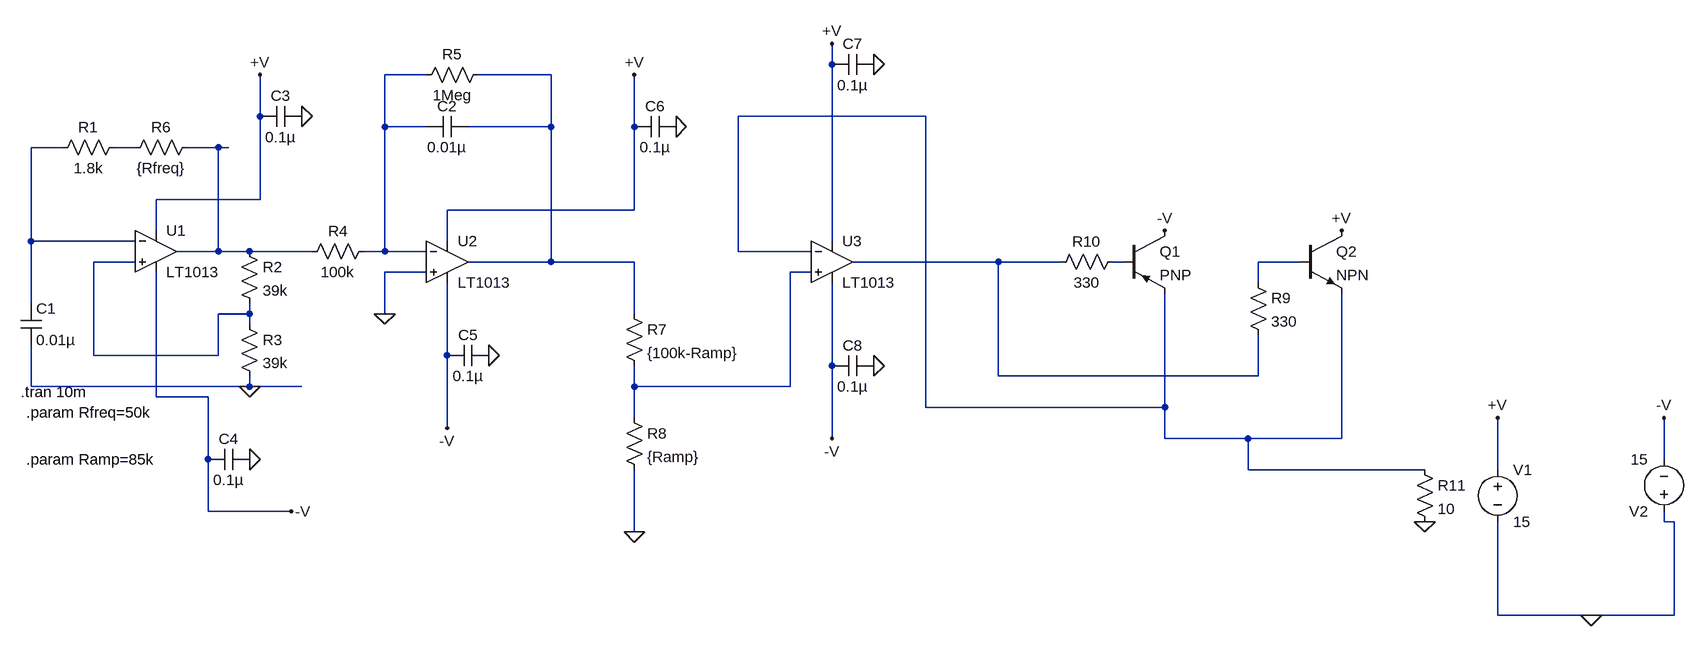
[diagram p0: schematic Function Generator LTspice.asc]
Function Generator LTspice.asc, the LTspice schematic file:
Version 4.1
SHEET 1 1684 680
WIRE 368 -272 368 -304
WIRE -256 -256 -320 -256
WIRE -64 -256 -176 -256
WIRE -512 -192 -512 -256
WIRE 512 -192 224 -192
WIRE -320 -176 -320 -256
WIRE -256 -176 -320 -176
WIRE -64 -176 -64 -256
WIRE -64 -176 -192 -176
WIRE 64 -176 64 -256
WIRE -816 -144 -864 -144
WIRE -704 -144 -736 -144
WIRE -576 -144 -624 -144
WIRE -560 -144 -576 -144
WIRE -512 -64 -512 -192
WIRE -512 -64 -672 -64
WIRE 64 -48 64 -176
WIRE 64 -48 -224 -48
WIRE -672 -16 -672 -64
WIRE -864 0 -864 -144
WIRE -704 0 -864 0
WIRE -224 0 -224 -48
WIRE 368 0 368 -272
WIRE -576 16 -576 -144
WIRE -576 16 -640 16
WIRE -528 16 -576 16
WIRE -432 16 -528 16
WIRE -320 16 -320 -176
WIRE -320 16 -352 16
WIRE -256 16 -320 16
WIRE 224 16 224 -192
WIRE 336 16 224 16
WIRE -704 32 -768 32
WIRE -64 32 -64 -176
WIRE -64 32 -192 32
WIRE 64 32 -64 32
WIRE 624 32 400 32
WIRE 720 32 624 32
WIRE 816 32 800 32
WIRE 1088 32 1024 32
WIRE -256 48 -320 48
WIRE 336 48 304 48
WIRE 1024 64 1024 32
WIRE -864 96 -864 0
WIRE -528 112 -528 96
WIRE -528 112 -576 112
WIRE -320 112 -320 48
WIRE 64 112 64 32
WIRE -528 128 -528 112
WIRE -768 176 -768 32
WIRE -576 176 -576 112
WIRE -576 176 -768 176
WIRE -224 176 -224 64
WIRE 368 192 368 64
WIRE 624 208 624 32
WIRE 1024 208 1024 144
WIRE 1024 208 624 208
WIRE -864 224 -864 160
WIRE -528 224 -528 208
WIRE -528 224 -864 224
WIRE -448 224 -528 224
WIRE 64 224 64 192
WIRE 304 224 304 48
WIRE 304 224 64 224
WIRE -672 240 -672 48
WIRE -592 240 -672 240
WIRE 512 256 512 -192
WIRE 880 256 880 80
WIRE 880 256 512 256
WIRE 64 272 64 224
WIRE -224 288 -224 176
WIRE 368 304 368 192
WIRE 880 304 880 256
WIRE 1008 304 880 304
WIRE 1152 304 1152 80
WIRE 1152 304 1008 304
WIRE -592 336 -592 240
WIRE 1648 336 1648 272
WIRE 1008 352 1008 304
WIRE 1280 352 1008 352
WIRE 1392 352 1392 272
WIRE -592 416 -592 336
WIRE -464 416 -592 416
WIRE 1648 432 1648 416
WIRE 1664 432 1648 432
WIRE 64 448 64 352
WIRE 1392 576 1392 432
WIRE 1536 576 1392 576
WIRE 1664 576 1664 432
WIRE 1664 576 1536 576
FLAG 1536 576 0
FLAG 1392 272 +V
FLAG -512 -256 +V
FLAG 1648 272 -V
FLAG -464 416 -V
FLAG -528 224 0
FLAG -320 112 0
FLAG 64 -256 +V
FLAG -224 288 -V
FLAG 64 448 0
FLAG 368 -304 +V
FLAG 368 304 -V
FLAG 1152 -16 +V
FLAG 880 -16 -V
FLAG 1280 432 0
FLAG -448 -192 0
FLAG -528 336 0
FLAG 128 -176 0
FLAG 432 -272 0
FLAG 432 192 0
FLAG -160 176 0
SYMBOL OpAmps\\LT1013 -672 -48 R0
SYMATTR InstName U1
SYMBOL cap -880 96 R0
SYMATTR InstName C1
SYMATTR Value 0.01µ
SYMBOL res -544 0 R0
SYMATTR InstName R2
SYMATTR Value 39k
SYMBOL res -544 112 R0
SYMATTR InstName R3
SYMATTR Value 39k
SYMBOL voltage 1392 336 R0
WINDOW 123 0 0 Left 0
WINDOW 39 0 0 Left 0
SYMATTR InstName V1
SYMATTR Value 15
SYMBOL voltage 1648 432 R180
WINDOW 123 0 0 Left 0
WINDOW 39 0 0 Left 0
SYMATTR InstName V2
SYMATTR Value 15
SYMBOL res -336 0 R90
WINDOW 0 0 56 VBottom 2
WINDOW 3 32 56 VTop 2
SYMATTR InstName R4
SYMATTR Value 100k
SYMBOL OpAmps\\LT1013 -224 -32 R0
SYMATTR InstName U2
SYMBOL cap -192 -192 R90
WINDOW 0 0 32 VBottom 2
WINDOW 3 32 32 VTop 2
SYMATTR InstName C2
SYMATTR Value 0.01µ
SYMBOL res -160 -272 R90
WINDOW 0 0 56 VBottom 2
WINDOW 3 32 56 VTop 2
SYMATTR InstName R5
SYMATTR Value 1Meg
SYMBOL res -720 -160 R90
WINDOW 0 0 56 VBottom 2
WINDOW 3 32 56 VTop 2
SYMATTR InstName R1
SYMATTR Value 1.8k
SYMBOL res -608 -160 R90
WINDOW 0 0 56 VBottom 2
WINDOW 3 32 56 VTop 2
SYMATTR InstName R6
SYMATTR Value {Rfreq}
SYMBOL res 48 96 R0
SYMATTR InstName R7
SYMATTR Value {100k-Ramp}
SYMBOL res 48 256 R0
SYMATTR InstName R8
SYMATTR Value {Ramp}
SYMBOL OpAmps\\LT1013 368 -32 R0
SYMATTR InstName U3
SYMBOL pnp 816 -16 R0
SYMATTR InstName Q1
SYMBOL npn 1088 -16 R0
SYMATTR InstName Q2
SYMBOL res 1008 48 R0
SYMATTR InstName R9
SYMATTR Value 330
SYMBOL res 816 16 R90
WINDOW 0 0 56 VBottom 2
WINDOW 3 32 56 VTop 2
SYMATTR InstName R10
SYMATTR Value 330
SYMBOL res 1264 336 R0
SYMATTR InstName R11
SYMATTR Value 10
SYMBOL cap -448 -208 R90
WINDOW 0 0 32 VBottom 2
WINDOW 3 32 32 VTop 2
SYMATTR InstName C3
SYMATTR Value 0.1µ
SYMBOL cap -528 320 R90
WINDOW 0 0 32 VBottom 2
WINDOW 3 32 32 VTop 2
SYMATTR InstName C4
SYMATTR Value 0.1µ
SYMBOL cap -160 160 R90
WINDOW 0 0 32 VBottom 2
WINDOW 3 32 32 VTop 2
SYMATTR InstName C5
SYMATTR Value 0.1µ
SYMBOL cap 128 -192 R90
WINDOW 0 0 32 VBottom 2
WINDOW 3 32 32 VTop 2
SYMATTR InstName C6
SYMATTR Value 0.1µ
SYMBOL cap 432 -288 R90
WINDOW 0 0 32 VBottom 2
WINDOW 3 32 32 VTop 2
SYMATTR InstName C7
SYMATTR Value 0.1µ
SYMBOL cap 432 176 R90
WINDOW 0 0 32 VBottom 2
WINDOW 3 32 32 VTop 2
SYMATTR InstName C8
SYMATTR Value 0.1µ
TEXT -880 232 Left 2 !.tran 10m
TEXT -872 264 Left 2 !.param Rfreq=50k
TEXT -872 336 Left 2 !.param Ramp=85k

The netlist it stands for:
* Function Generator LTspice.asc
X§U1 N007 N004 +V -V N006 LT1013  ; pins In+ In- V+ V- OUT
C1 N004 0 0.01µ
R2 N006 N007 39k
R3 N007 0 39k
V1 +V 0 15
V2 0 -V 15
R4 N001 N006 100k
X§U2 0 N001 +V -V N002 LT1013  ; pins In+ In- V+ V- OUT
C2 N002 N001 0.01µ
R5 N002 N001 1Meg
R1 N005 N004 1.8k
R6 N006 N005 {Rfreq}
R7 N002 N011 {100k-Ramp}
R8 N011 0 {Ramp}
X§U3 N011 N003 +V -V N008 LT1013  ; pins In+ In- V+ V- OUT
Q1 -V N009 N003 0 PNP
Q2 +V N010 N003 0 NPN
R9 N010 N008 330
R10 N009 N008 330
R11 N003 0 10
C3 0 +V 0.1µ
C4 0 -V 0.1µ
C5 0 -V 0.1µ
C6 0 +V 0.1µ
C7 0 +V 0.1µ
C8 0 -V 0.1µ
.model NPN NPN
.model PNP PNP
.lib standard.bjt
.tran 10m
.param Rfreq=50k
.param Ramp=85k
.lib LTC.lib
.backanno
.end